# Altium schematic sheet 02_CM4 Module.SchDoc
size A3
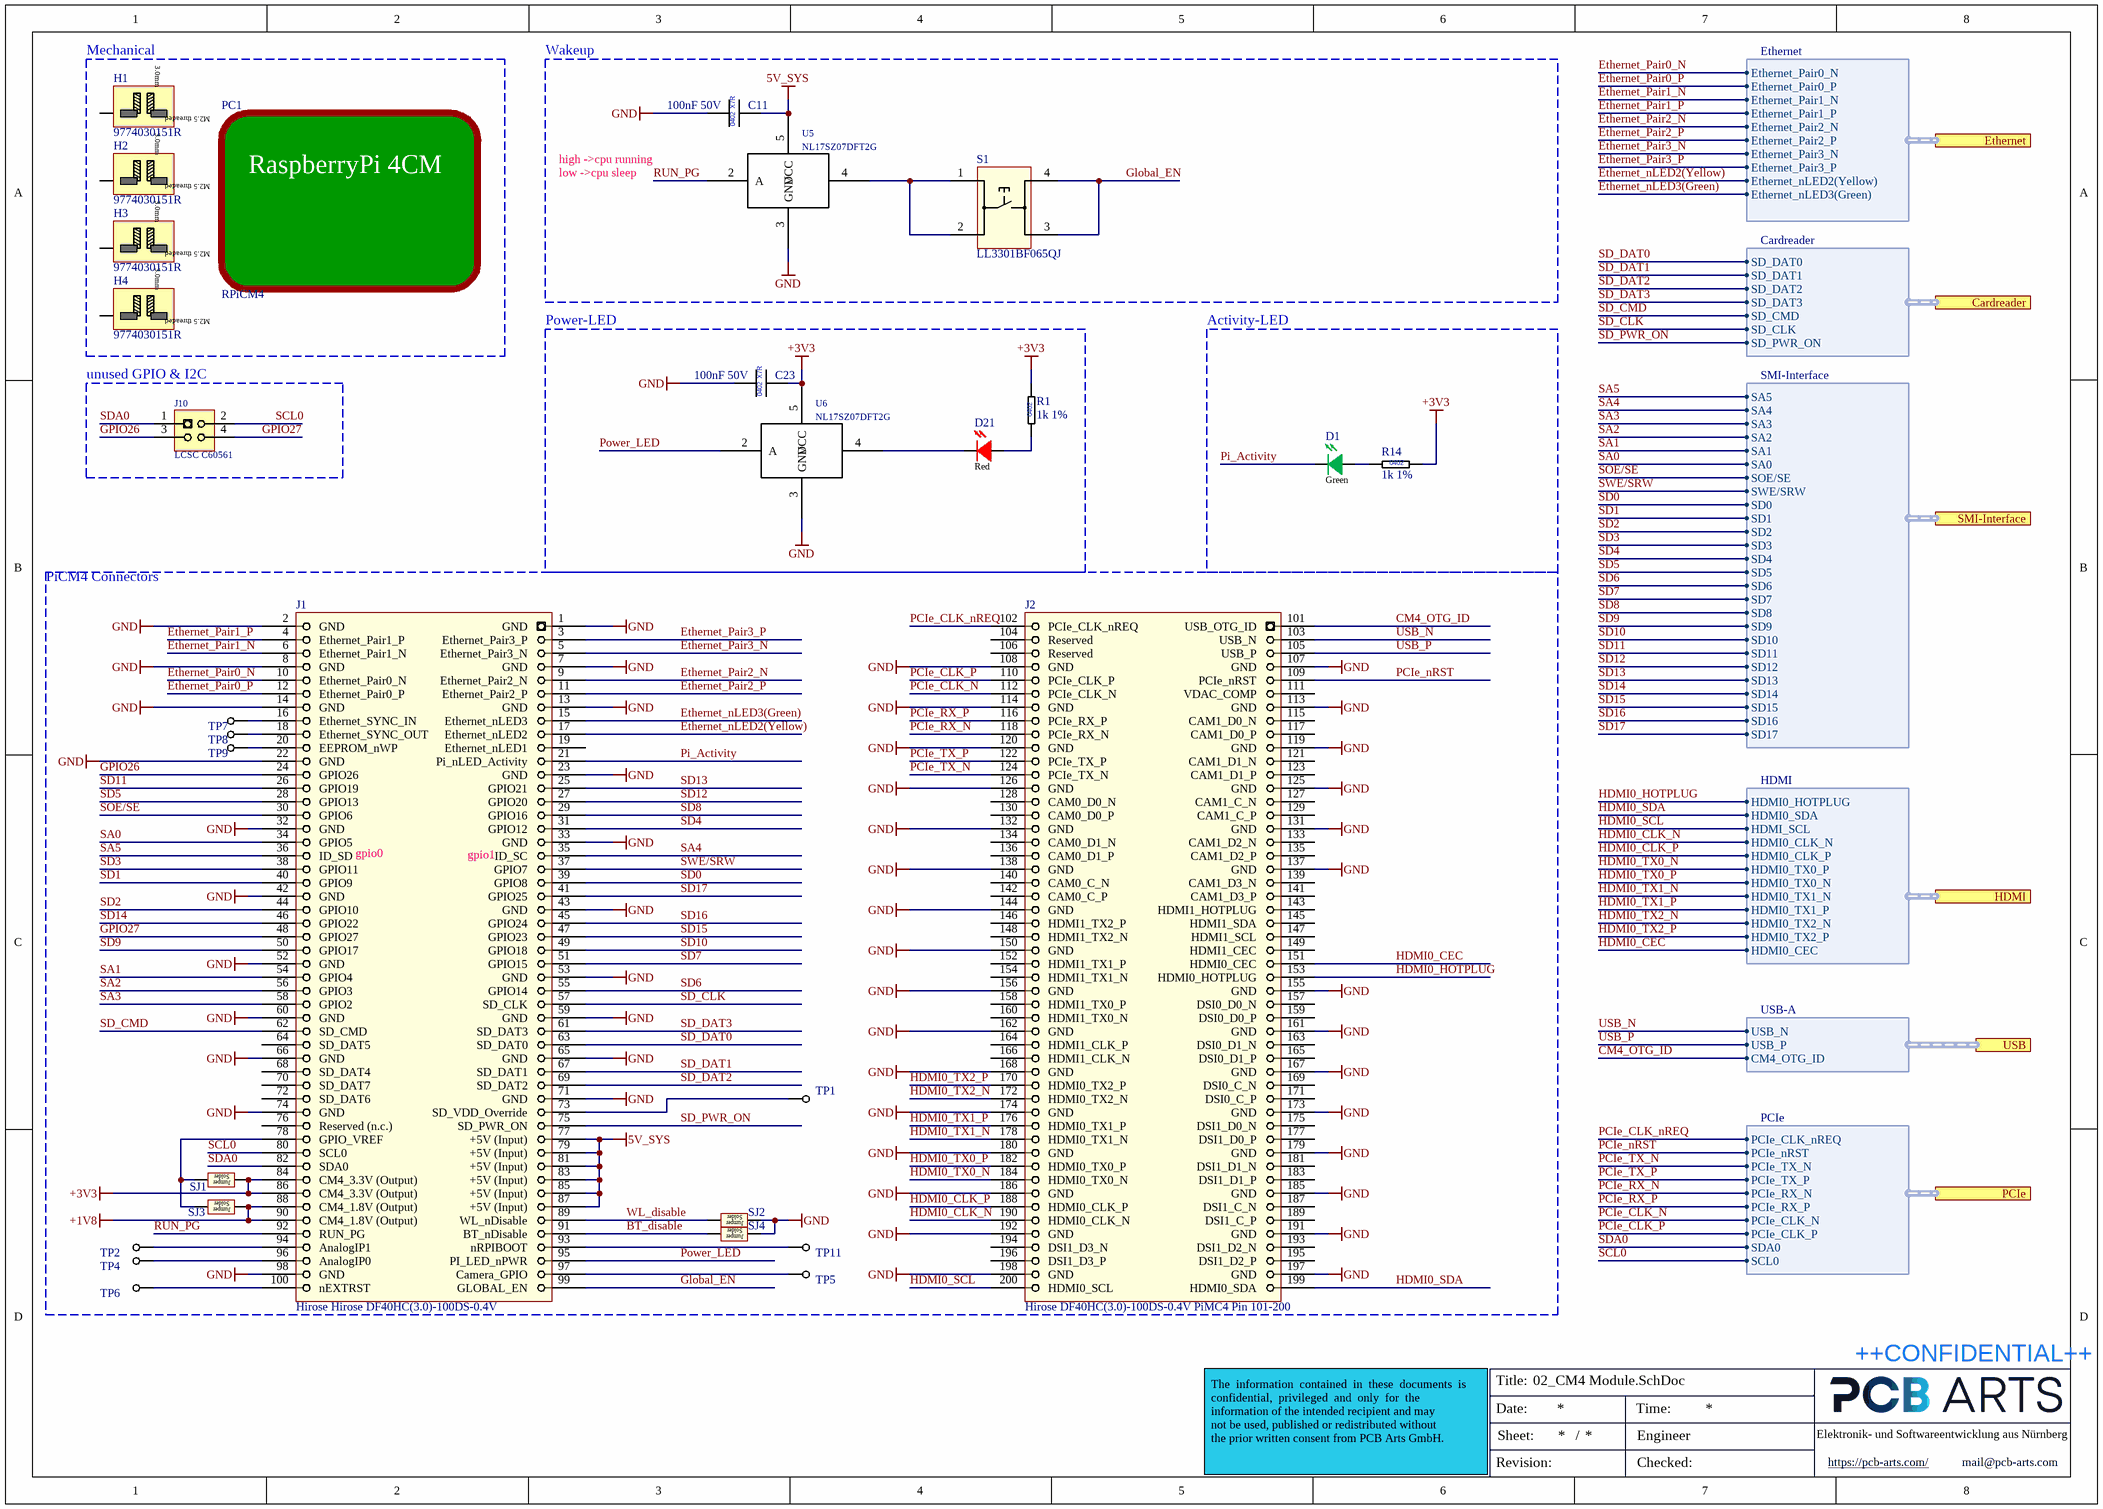
[diagram p0: 02_CM4 Module.SchDoc]

## Parts
C11  100nF 50V  [CAP_0402]
C23  100nF 50V  [CAP_0402]
D1  Color: Green  [LED-0603 Sideview]  (hidden comment: LTST-S270KGKT)
D21  Color: Red  [LED-0603 Sideview]  (hidden comment: LTST-S270KRKT)
H1  9774030151R  [9774030151R]
H2  9774030151R  [9774030151R]
H3  9774030151R  [9774030151R]
H4  9774030151R  [9774030151R]
J1  Hirose Hirose DF40HC(3.0)-100DS-0.4V  [Hirose DF40HC(3.0)-100DS-0.4V_1-100]
J2  Hirose DF40HC(3.0)-100DS-0.4V PiMC4 Pin 101-200  [Hirose DF40HC(3.0)-100DS-0.4V_PiCM4_101_200]
J10  LCSC C60561  [LCSC C60561]
PC1  RPiCM4  [RaspberryPi_CM4]
R1  1k 1%  [RES_0402]
R14  1k 1%  [RES_0402]
S1  LL3301BF065QJ  [LL3301BF065QJ]
SJ1  Solderbridge_0402  [Solderbridge_0402]  (value not drawn)
SJ2  Solderbridge_0402  [Solderbridge_0402]  (value not drawn)
SJ3  Solderbridge_0402  [Solderbridge_0402]  (value not drawn)
SJ4  Solderbridge_0402  [Solderbridge_0402]  (value not drawn)
TP1  Testpoint  [Testpoint 0.8mm]  (value not drawn)  (no BOM)
TP2  Testpoint  [Testpoint 0.8mm]  (value not drawn)  (no BOM)
TP4  Testpoint  [Testpoint 0.8mm]  (value not drawn)  (no BOM)
TP5  Testpoint  [Testpoint 0.8mm]  (value not drawn)  (no BOM)
TP6  Testpoint  [Testpoint 0.8mm]  (value not drawn)  (no BOM)
TP7  Testpoint  [Testpoint 0.8mm]  (value not drawn)  (no BOM)
TP8  Testpoint  [Testpoint 0.8mm]  (value not drawn)  (no BOM)
TP9  Testpoint  [Testpoint 0.8mm]  (value not drawn)  (no BOM)
TP11  Testpoint  [Testpoint 0.8mm]  (value not drawn)  (no BOM)
U5  NL17SZ07DFT2G  [SOT65P210X110-5N]
U6  NL17SZ07DFT2G  [SOT65P210X110-5N]

## Blocks framed on the sheet
Mechanical: H1-H4 PC1
Wakeup: C11 S1 U5
Power-LED: C23 D21 R1 U6
Activity-LED: D1 R14
unused GPIO & I2C: J10
PiCM4 Connectors: J1 J2 SJ1-SJ4 TP1 TP2 TP4-TP9 TP11

## Ports
Cardreader (harness Cardreader), Ethernet (harness Ethernet), HDMI (harness HDMI), PCIe (harness PCIe), SMI-Interface (harness SMI-Interface), USB (harness USB-A)

## Harnesses
Ethernet: Ethernet_Pair0_N, Ethernet_Pair0_P, Ethernet_Pair1_N, Ethernet_Pair1_P, Ethernet_Pair2_N, Ethernet_Pair2_P, Ethernet_Pair3_N, Ethernet_Pair3_P, Ethernet_nLED2(Yellow), Ethernet_nLED3(Green)
Cardreader: SD_DAT0, SD_DAT1, SD_DAT2, SD_DAT3, SD_CMD, SD_CLK, SD_PWR_ON
SMI-Interface: SA5, SA4, SA3, SA2, SA1, SA0, SOE/SE, SWE/SRW, SD0, SD1, SD2, SD3, SD4, SD5, SD6, SD7, SD8, SD9, SD10, SD11, SD12, SD13, SD14, SD15, SD16, SD17
HDMI: HDMI0_HOTPLUG, HDMI0_SDA, HDMI_SCL, HDMI0_CLK_N, HDMI0_CLK_P, HDMI0_TX0_P, HDMI0_TX0_N, HDMI0_TX1_N, HDMI0_TX1_P, HDMI0_TX2_N, HDMI0_TX2_P, HDMI0_CEC
PCIe: PCIe_CLK_nREQ, PCIe_nRST, PCIe_TX_N, PCIe_TX_P, PCIe_RX_N, PCIe_RX_P, PCIe_CLK_N, PCIe_CLK_P, SDA0, SCL0
USB-A: USB_N, USB_P, CM4_OTG_ID

## Nets
5V_SYS: C11.2 J1.77(+5V_(Input)) J1.79(+5V_(Input)) J1.81(+5V_(Input)) J1.83(+5V_(Input)) J1.85(+5V_(Input)) J1.87(+5V_(Input)) U5.5(VCC)
+1V8: J1.88(CM4_1.8V_(Output)) J1.90(CM4_1.8V_(Output)) SJ3.2
+3V3: C23.2 J1.84(CM4_3.3V_(Output)) J1.86(CM4_3.3V_(Output)) R1.2 R14.2 SJ1.2 U6.5(VCC)
GND: C11.1 C23.1 J1.1(GND) J1.2(GND) J1.7(GND) J1.8(GND) J1.13(GND) J1.14(GND) J1.22(GND) J1.23(GND) J1.32(GND) J1.33(GND) J1.42(GND) J1.43(GND) J1.52(GND) J1.53(GND) J1.59(GND) J1.60(GND) J1.65(GND) J1.66(GND) J1.71(GND) J1.74(GND) J1.98(GND) J2.107(GND) J2.108(GND) J2.113(GND) J2.114(GND) J2.119(GND) J2.120(GND) J2.125(GND) J2.126(GND) J2.131(GND) J2.132(GND) J2.137(GND) J2.138(GND) J2.144(GND) J2.150(GND) J2.155(GND) J2.156(GND) J2.161(GND) J2.162(GND) J2.167(GND) J2.168(GND) J2.173(GND) J2.174(GND) J2.179(GND) J2.180(GND) J2.185(GND) J2.186(GND) J2.191(GND) J2.192(GND) J2.197(GND) J2.198(GND) SJ2.2 SJ4.2 U5.3(GND) U6.3(GND)
BT_disable: J1.91(BT_nDisable) SJ4.1
CM4_OTG_ID: J2.101(USB_OTG_ID) ; port USB.CM4_OTG_ID
Ethernet_nLED2(Yellow): J1.17(Ethernet_nLED2) ; port Ethernet.Ethernet_nLED2(Yellow)
Ethernet_nLED3(Green): J1.15(Ethernet_nLED3) ; port Ethernet.Ethernet_nLED3(Green)
Ethernet_Pair0_N: J1.10(Ethernet_Pair0_N) ; port Ethernet.Ethernet_Pair0_N
Ethernet_Pair0_P: J1.12(Ethernet_Pair0_P) ; port Ethernet.Ethernet_Pair0_P
Ethernet_Pair1_N: J1.6(Ethernet_Pair1_N) ; port Ethernet.Ethernet_Pair1_N
Ethernet_Pair1_P: J1.4(Ethernet_Pair1_P) ; port Ethernet.Ethernet_Pair1_P
Ethernet_Pair2_N: J1.9(Ethernet_Pair2_N) ; port Ethernet.Ethernet_Pair2_N
Ethernet_Pair2_P: J1.11(Ethernet_Pair2_P) ; port Ethernet.Ethernet_Pair2_P
Ethernet_Pair3_N: J1.5(Ethernet_Pair3_N) ; port Ethernet.Ethernet_Pair3_N
Ethernet_Pair3_P: J1.3(Ethernet_Pair3_P) ; port Ethernet.Ethernet_Pair3_P
Global_EN: J1.99(GLOBAL_EN) S1.3 S1.4
GPIO26: J1.24(GPIO26) J10.3
GPIO27: J1.48(GPIO27) J10.4
HDMI0_CEC: J2.151(HDMI0_CEC) ; port HDMI.HDMI0_CEC
HDMI0_CLK_N: J2.190(HDMI0_CLK_N) ; port HDMI.HDMI0_CLK_N
HDMI0_CLK_P: J2.188(HDMI0_CLK_P) ; port HDMI.HDMI0_CLK_P
HDMI0_HOTPLUG: J2.153(HDMI0_HOTPLUG) ; port HDMI.HDMI0_HOTPLUG
HDMI0_SCL: J2.200(HDMI0_SCL) ; port HDMI.HDMI_SCL
HDMI0_SDA: J2.199(HDMI0_SDA) ; port HDMI.HDMI0_SDA
HDMI0_TX0_N: J2.184(HDMI0_TX0_N) ; port HDMI.HDMI0_TX0_P
HDMI0_TX0_P: J2.182(HDMI0_TX0_P) ; port HDMI.HDMI0_TX0_N
HDMI0_TX1_N: J2.178(HDMI0_TX1_N) ; port HDMI.HDMI0_TX1_N
HDMI0_TX1_P: J2.176(HDMI0_TX1_P) ; port HDMI.HDMI0_TX1_P
HDMI0_TX2_N: J2.172(HDMI0_TX2_N) ; port HDMI.HDMI0_TX2_N
HDMI0_TX2_P: J2.170(HDMI0_TX2_P) ; port HDMI.HDMI0_TX2_P
PCIe_CLK_N: J2.112(PCIe_CLK_N) ; port PCIe.PCIe_CLK_N
PCIe_CLK_nREQ: J2.102(PCIe_CLK_nREQ) ; port PCIe.PCIe_CLK_nREQ
PCIe_CLK_P: J2.110(PCIe_CLK_P) ; port PCIe.PCIe_CLK_P
PCIe_nRST: J2.109(PCIe_nRST) ; port PCIe.PCIe_nRST
PCIe_RX_N: J2.118(PCIe_RX_N) ; port PCIe.PCIe_RX_N
PCIe_RX_P: J2.116(PCIe_RX_P) ; port PCIe.PCIe_RX_P
PCIe_TX_N: J2.124(PCIe_TX_N) ; port PCIe.PCIe_TX_N
PCIe_TX_P: J2.122(PCIe_TX_P) ; port PCIe.PCIe_TX_P
Pi_Activity: D1.1 J1.21(Pi_nLED_Activity)
Power_LED: J1.95(PI_LED_nPWR) U6.2(A)
RUN_PG: J1.92(RUN_PG) U5.2(A)
SA0: J1.34(GPIO5) ; port SMI-Interface.SA0
SA1: J1.54(GPIO4) ; port SMI-Interface.SA1
SA2: J1.56(GPIO3) ; port SMI-Interface.SA2
SA3: J1.58(GPIO2) ; port SMI-Interface.SA3
SA4: J1.35(ID_SC) ; port SMI-Interface.SA4
SA5: J1.36(ID_SD) ; port SMI-Interface.SA5
SCL0: J1.80(SCL0) J10.2 ; port PCIe.SCL0
SD0: J1.39(GPIO8) ; port SMI-Interface.SD0
SD1: J1.40(GPIO9) ; port SMI-Interface.SD1
SD2: J1.44(GPIO10) ; port SMI-Interface.SD2
SD3: J1.38(GPIO11) ; port SMI-Interface.SD3
SD4: J1.31(GPIO12) ; port SMI-Interface.SD4
SD5: J1.28(GPIO13) ; port SMI-Interface.SD5
SD6: J1.55(GPIO14) ; port SMI-Interface.SD6
SD7: J1.51(GPIO15) ; port SMI-Interface.SD7
SD8: J1.29(GPIO16) ; port SMI-Interface.SD8
SD9: J1.50(GPIO17) ; port SMI-Interface.SD9
SD10: J1.49(GPIO18) ; port SMI-Interface.SD10
SD11: J1.26(GPIO19) ; port SMI-Interface.SD11
SD12: J1.27(GPIO20) ; port SMI-Interface.SD12
SD13: J1.25(GPIO21) ; port SMI-Interface.SD13
SD14: J1.46(GPIO22) ; port SMI-Interface.SD14
SD15: J1.47(GPIO23) ; port SMI-Interface.SD15
SD16: J1.45(GPIO24) ; port SMI-Interface.SD16
SD17: J1.41(GPIO25) ; port SMI-Interface.SD17
SD_CLK: J1.57(SD_CLK) ; port Cardreader.SD_CLK
SD_CMD: J1.62(SD_CMD) ; port Cardreader.SD_CMD
SD_DAT0: J1.63(SD_DAT0) ; port Cardreader.SD_DAT0
SD_DAT1: J1.67(SD_DAT1) ; port Cardreader.SD_DAT1
SD_DAT2: J1.69(SD_DAT2) ; port Cardreader.SD_DAT2
SD_DAT3: J1.61(SD_DAT3) ; port Cardreader.SD_DAT3
SD_PWR_ON: J1.75(SD_PWR_ON) ; port Cardreader.SD_PWR_ON
SDA0: J1.82(SDA0) J10.1 ; port PCIe.SDA0
SOE/SE: J1.30(GPIO6) ; port SMI-Interface.SOE/SE
SWE/SRW: J1.37(GPIO7) ; port SMI-Interface.SWE/SRW
USB_N: J2.103(USB_N) ; port USB.USB_N
USB_P: J2.105(USB_P) ; port USB.USB_P
WL_disable: J1.89(WL_nDisable) SJ2.1
NetD1_2: D1.2 R14.1
NetD21_1: D21.1 U6.4(Y)
NetD21_2: D21.2 R1.1
NetJ1_16: J1.16(Ethernet_SYNC_IN) TP7.1(GND)
NetJ1_18: J1.18(Ethernet_SYNC_OUT) TP8.1(GND)
NetJ1_20: J1.20(EEPROM_nWP) TP9.1(GND)
NetJ1_73: J1.73(SD_VDD_Override) TP1.1(GND)
NetJ1_78: J1.78(GPIO_VREF) SJ1.1 SJ3.1
NetJ1_93: J1.93(nRPIBOOT) TP11.1(GND)
NetJ1_94: J1.94(AnalogIP1) TP2.1(GND)
NetJ1_96: J1.96(AnalogIP0) TP4.1(GND)
NetJ1_97: J1.97(Camera_GPIO) TP5.1(GND)
NetJ1_100: J1.100(nEXTRST) TP6.1(GND)
NetS1_1: S1.1 S1.2 U5.4(Y)

Not connected (* = marked no-connect by the designer): H1 1; H2 1; H3 1; H4 1; J1 19(Ethernet_nLED1) 64(SD_DAT5) 68(SD_DAT4) 70(SD_DAT7) 72(SD_DAT6) 76(Reserved_(n.c.)); J2 104(Reserved) 106(Reserved) 111(VDAC_COMP) 115(CAM1_D0_N) 117(CAM1_D0_P) 121(CAM1_D1_N) 123(CAM1_D1_P) 127(CAM1_C_N) 128(CAM0_D0_N) 129(CAM1_C_P) 130(CAM0_D0_P) 133(CAM1_D2_N) 134(CAM0_D1_N) 135(CAM1_D2_P) 136(CAM0_D1_P) 139(CAM1_D3_N) 140(CAM0_C_N) 141(CAM1_D3_P) 142(CAM0_C_P) 143(HDMI1_HOTPLUG) 145(HDMI1_SDA) 146(HDMI1_TX2_P) 147(HDMI1_SCL) 148(HDMI1_TX2_N) 149(HDMI1_CEC) 152(HDMI1_TX1_P) 154(HDMI1_TX1_N) 157(DSI0_D0_N) 158(HDMI1_TX0_P) 159(DSI0_D0_P) 160(HDMI1_TX0_N) 163(DSI0_D1_N) 164(HDMI1_CLK_P) 165(DSI0_D1_P) 166(HDMI1_CLK_N) 169(DSI0_C_N) 171(DSI0_C_P) 175(DSI1_D0_N) 177(DSI1_D0_P) 181(DSI1_D1_N) 183(DSI1_D1_P) 187(DSI1_C_N) 189(DSI1_C_P) 193(DSI1_D2_N) 194(DSI1_D3_N) 195(DSI1_D2_P) 196(DSI1_D3_P)

## Notes on the sheet
- high ->cpu running
- low ->cpu sleep
- (near J1) gpio0
- (near J1) gpio1
- Title:
- ++CONFIDENTIAL++
- Date:
- Sheet:
- /
- Time:
- Engineer
- Elektronik- und Softwareentwicklung aus Nürnberg
- The  information  contained  in  these  documents  is  confidential,  privileged  and  only  for  the
  information of the intended recipient and may
  not be used, published or redistributed without
  the prior written consent from PCB Arts GmbH.
- Revision:
- Checked:
- https://pcb-arts.com/
- mail@pcb-arts.com
- (in symbol CAP_0402_100nF_50V) X7R; 0402
- (in symbol Raspberry Pi Compute Module 4) RaspberryPi 4CM
- (in symbol RES_0402_1k_1%) 0402
- (in symbol Solderbridge_0402) Solder; Jumper
- (in symbol Würth Standoff M2.5 h:3.0mm) 3.0mm; M2.5 threaded

## Library data of the parts
C11 C23 = CAP_0402_100nF_50V: Multilayer Ceramic Capacitors MLCC - SMD/SMT 0402 50VDC; Manufacturer 1: Murata Electronics; Manufacturer 1 Prt. Nr.: GCM155L8EH104KE07D; Manufacturer 2 Prt. Nr.: UMK105B7104KV-FR; Manufacturer 2: TDK
D1 = LED 0603 Green Sideview: GREEN  0603 Light Emitting Diode; Manufacturer 1: lite-On; Manufacturer 1 Prt. Nr.: LTST-S270KGKT
D21 = LED 0603 Red Sideview: RED  0603 Light Emitting Diode; Manufacturer 1: lite-On; Manufacturer 1 Prt. Nr.: LTST-S270KRKT
H1-H4 = Würth Standoff M2.5 h:3.0mm: Würth Standoff M2.5 h:3.0mm 9774030151R; Manufacturer 1: Würth Elektronik; Manufacturer 1 Prt. Nr.: 9774030151R
J1 = DF40HC(3.0)-100DS-0.4V RPiCM4 Pin 1-100: Hirose DF40HC(3.0)-100DS-0.4V 3mm heigth receptacle for Raspberry Pi CM4, Pin 1-100; Manufacturer 1: Hirose; Manufacturer 1 Prt. Nr.: DF40HC(3.0)-100DS-0.4V
J2 = DF40HC(3.0)-100DS-0.4V RPiCM4 Pin 101-200: Hirose DF40C-100DS-0.4V 3mm heigth receptacle for Raspberry Pi CM4, Pin 101-200; Manufacturer 1: Hirose; Manufacturer 1 Prt. Nr.: DF40HC(3.0)-100DS-0.4V
J10 = LCSC C60561_Pin header 2.54mm 4Pol right angle: Pin header 2.54mm 4Pol right angle; Manufacturer 1: BOOMELE(Boom Precision Elec); Manufacturer 1 Prt. Nr.: C60561
PC1 = Raspberry Pi Compute Module 4: Raspberry Pi 4 Compute Module 4; Manufacturer 1: Raspberry Pi; Manufacturer 1 Prt. Nr.: Compute Module 4
R1 R14 = RES_0402_1k_1%: Thick Film Resistors - SMD 1kOhm 1%; Manufacturer 1: Vishay / Dale; Manufacturer 1 Prt. Nr.: CRCW04021K00FKEDC; Manufacturer 2 Prt. Nr.: RC0402FR-7W1KL; Manufacturer 2: Yageo
S1 = LL3301BF065QJ_SPST Top Actuated  Button, 65gf, SMD h: 9.8mm: SPST Top Actuated  Button, 65gf, SMD h: 9.8mm; Manufacturer 1: E-Switch; Manufacturer 1 Prt. Nr.: LL3301BF065QJ
TP1 TP2 TP4-TP9 TP11 = Testpoint 0.8mm
U5 U6 = NL17SZ07DFT2G_Buffer 1.65-5.5V Single Non-Inverting: Puffer u. Leitungstreiber 1.65-5.5V Single Non-Inverting; Manufacturer 1: ON Semiconductor; Manufacturer 1 Prt. Nr.: NL17SZ07DFT2G